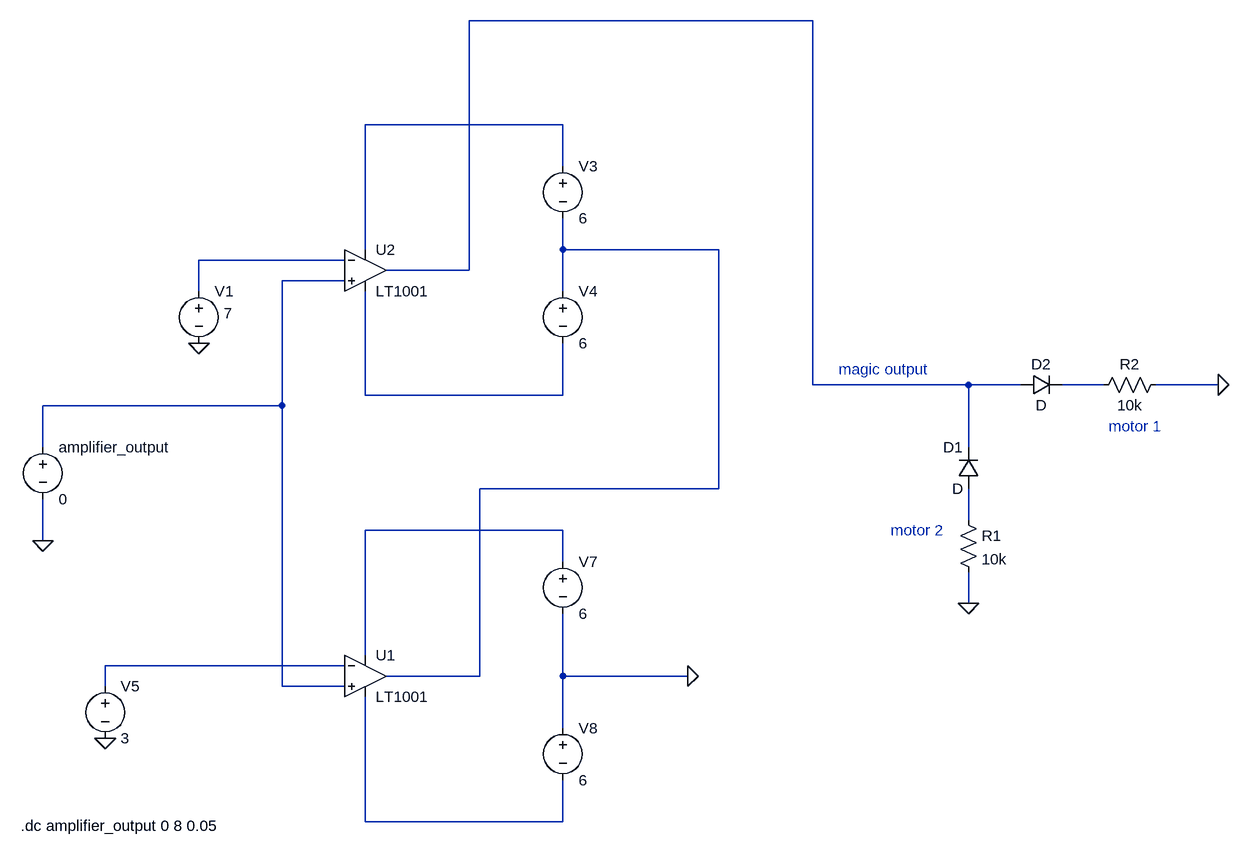
[diagram p0: schematic comparator_logic_IE.asc]
comparator_logic_IE.asc, the LTspice schematic file:
Version 4
SHEET 1 1540 1016
WIRE 896 -240 368 -240
WIRE 512 -80 208 -80
WIRE 512 -16 512 -80
WIRE 208 112 208 -80
WIRE 512 112 512 64
WIRE 752 112 512 112
WIRE 176 128 -48 128
WIRE 368 144 368 -240
WIRE 368 144 240 144
WIRE 176 160 80 160
WIRE -48 176 -48 128
WIRE 512 176 512 112
WIRE 896 320 896 -240
WIRE 1136 320 896 320
WIRE 1216 320 1136 320
WIRE 1344 320 1280 320
WIRE 1520 320 1424 320
WIRE 208 336 208 176
WIRE 512 336 512 256
WIRE 512 336 208 336
WIRE 80 352 80 160
WIRE 80 352 -288 352
WIRE -288 416 -288 352
WIRE 1136 416 1136 320
WIRE 752 480 752 112
WIRE 752 480 384 480
WIRE 1136 528 1136 480
WIRE 512 544 208 544
WIRE -288 560 -288 496
WIRE 512 592 512 544
WIRE 1136 656 1136 608
WIRE 208 736 208 544
WIRE 176 752 -192 752
WIRE 384 768 384 480
WIRE 384 768 240 768
WIRE 512 768 512 672
WIRE 704 768 512 768
WIRE -192 784 -192 752
WIRE 80 784 80 352
WIRE 176 784 80 784
WIRE 512 848 512 768
WIRE 208 992 208 800
WIRE 512 992 512 928
WIRE 512 992 208 992
FLAG -192 864 0
FLAG 704 768 0
FLAG -48 256 0
FLAG 1136 656 0
FLAG 1520 320 0
FLAG -288 560 0
SYMBOL voltage -48 160 R0
WINDOW 3 38 50 Left 2
WINDOW 123 0 0 Left 0
WINDOW 39 0 0 Left 0
SYMATTR Value 7
SYMATTR InstName V1
SYMBOL voltage 512 -32 R0
WINDOW 123 0 0 Left 0
WINDOW 39 0 0 Left 0
SYMATTR InstName V3
SYMATTR Value 6
SYMBOL voltage 512 160 R0
WINDOW 123 0 0 Left 0
WINDOW 39 0 0 Left 0
SYMATTR InstName V4
SYMATTR Value 6
SYMBOL OpAmps\\LT1001 208 704 R0
SYMATTR InstName U1
SYMBOL OpAmps\\LT1001 208 80 R0
SYMATTR InstName U2
SYMBOL voltage -192 768 R0
WINDOW 123 0 0 Left 0
WINDOW 39 0 0 Left 0
SYMATTR InstName V5
SYMATTR Value 3
SYMBOL voltage 512 576 R0
WINDOW 123 0 0 Left 0
WINDOW 39 0 0 Left 0
SYMATTR InstName V7
SYMATTR Value 6
SYMBOL voltage 512 832 R0
WINDOW 123 0 0 Left 0
WINDOW 39 0 0 Left 0
SYMATTR InstName V8
SYMATTR Value 6
SYMBOL diode 1152 480 R180
WINDOW 0 24 64 Left 2
WINDOW 3 24 0 Left 2
SYMATTR InstName D1
SYMBOL diode 1216 336 R270
WINDOW 0 32 32 VTop 2
WINDOW 3 0 32 VBottom 2
SYMATTR InstName D2
SYMBOL res 1440 304 R90
WINDOW 0 0 56 VBottom 2
WINDOW 3 32 56 VTop 2
SYMATTR InstName R2
SYMATTR Value 10k
SYMBOL res 1120 512 R0
SYMATTR InstName R1
SYMATTR Value 10k
SYMBOL voltage -288 400 R0
WINDOW 123 0 0 Left 0
WINDOW 39 0 0 Left 0
SYMATTR InstName amplifier_output
SYMATTR Value 0
TEXT 936 296 Left 2 ;magic output
TEXT 1352 384 Left 2 ;motor 1
TEXT 1016 544 Left 2 ;motor 2
TEXT -322 998 Left 2 !.dc amplifier_output 0 8 0.05

The netlist it stands for:
* comparator_logic_IE.asc
V1 N004 0 7
V3 N002 N003 6
V4 N003 N007 6
XU1 N005 N010 N009 N011 N003 LT1001  ; pins In+ In- V+ V- OUT
XU2 N005 N004 N002 N007 N001 LT1001  ; pins In+ In- V+ V- OUT
V5 N010 0 3
V7 N009 0 6
V8 0 N011 6
D1 N008 N001 D
D2 N001 N006 D
R2 0 N006 10k
R1 N008 0 10k
V§amplifier_output N005 0 0
.model D D
.lib standard.dio
* magic output
* motor 1
* motor 2
.dc amplifier_output 0 8 0.05
.lib LTC.lib
.backanno
.end